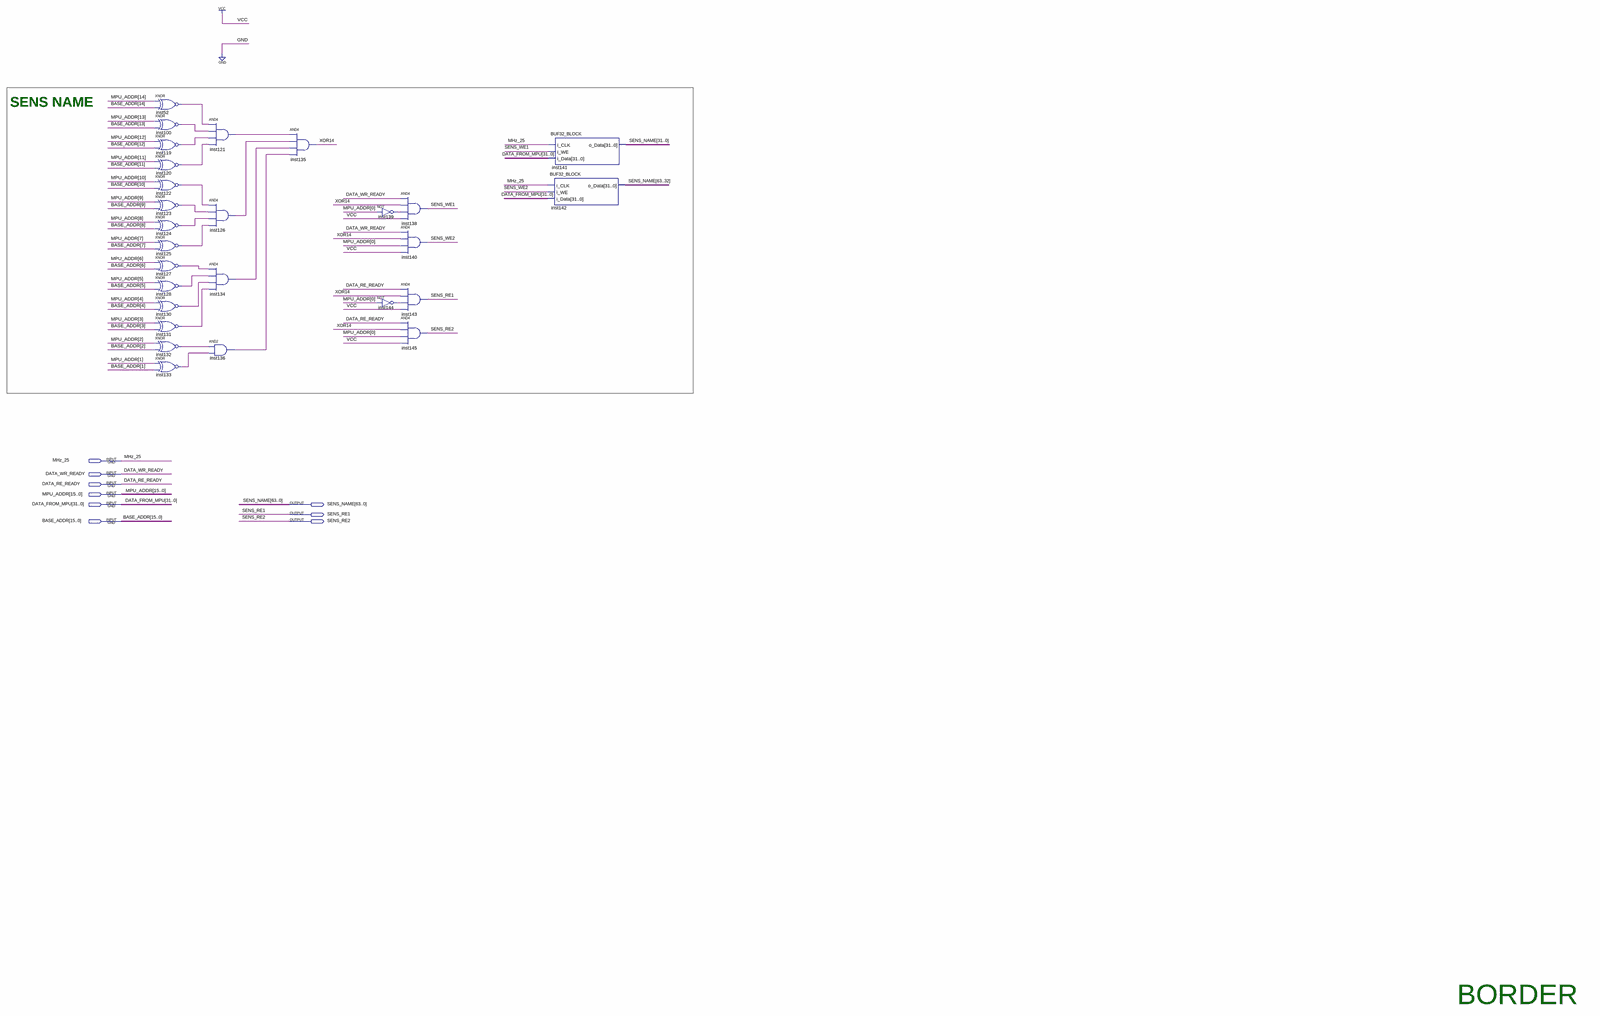
[diagram p0: schematic sheet, whole]
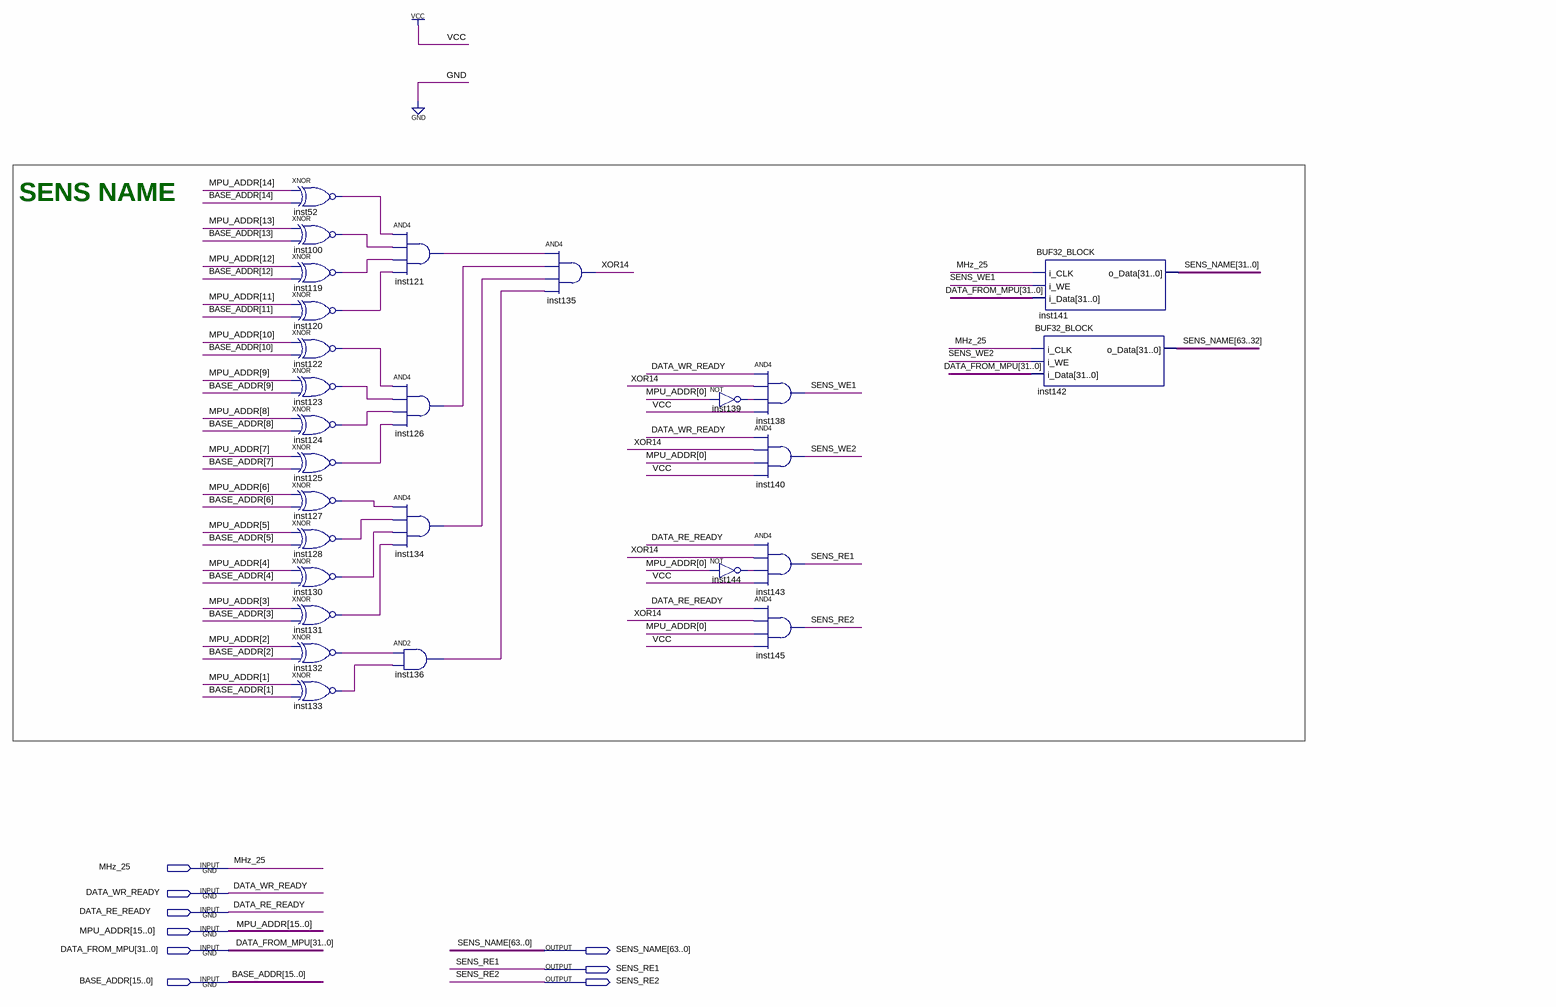
[diagram p1: schematic sheet, upper left part]
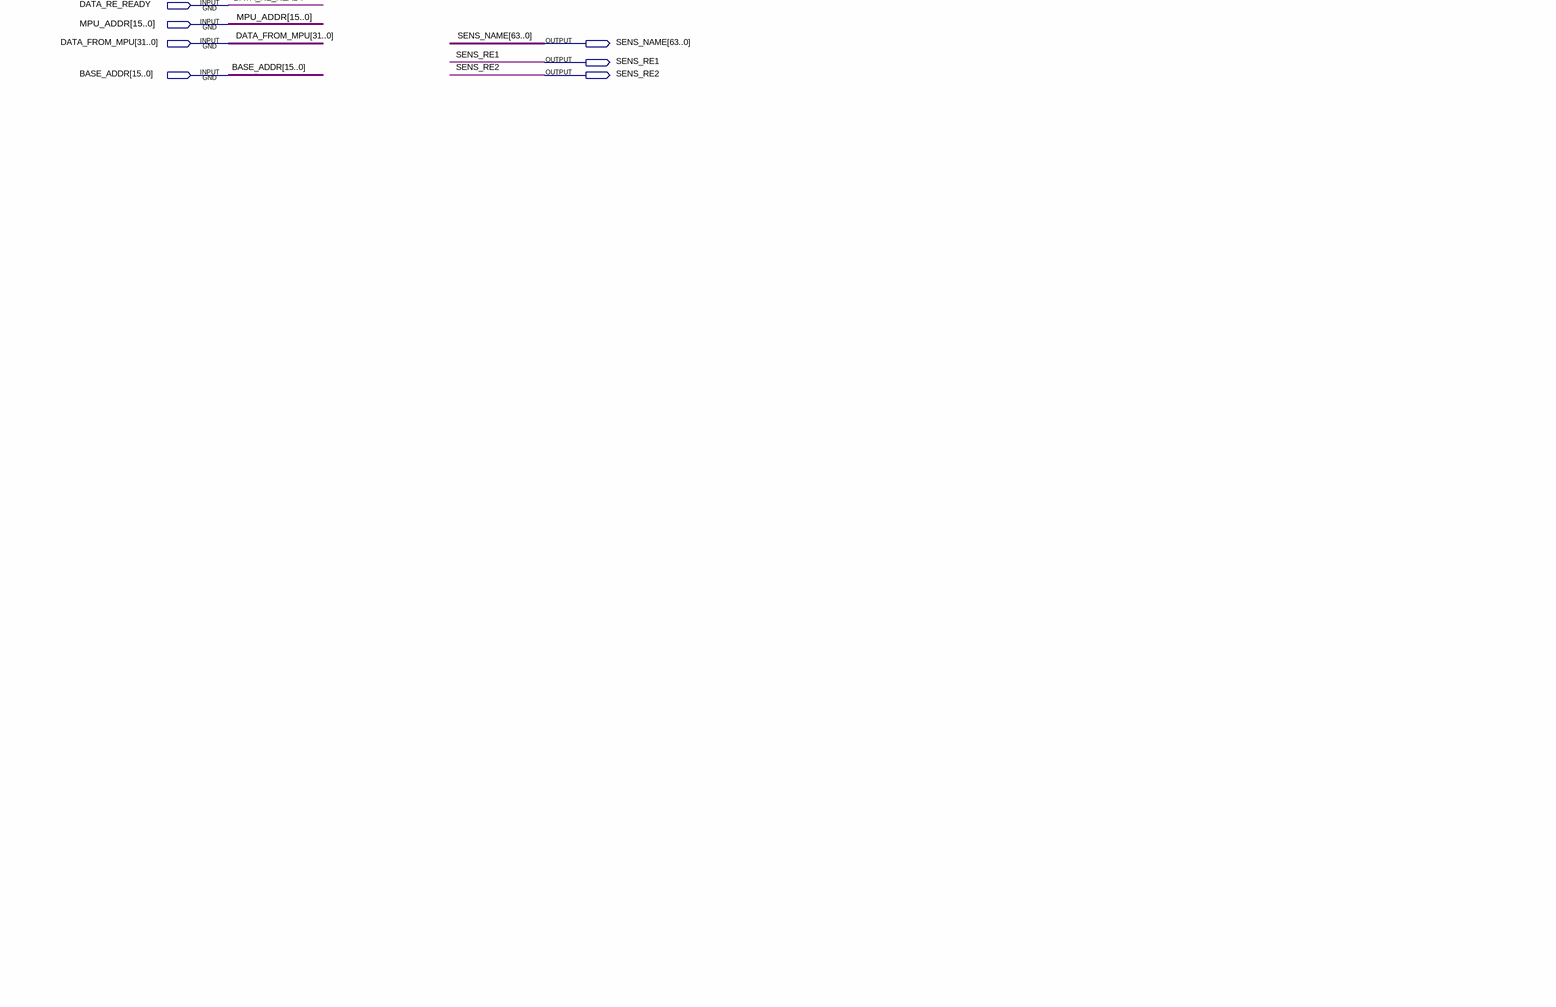
[diagram p2: schematic sheet, lower left part]
// Quartus schematic SENS_NAME.bdf as structural Verilog: 27 symbols, 9 pins
module SENS_NAME (
  input  MHz_25,
  input  DATA_WR_READY,
  input  DATA_RE_READY,
  input  [15:0] MPU_ADDR,
  input  [31:0] DATA_FROM_MPU,
  input  [15:0] BASE_ADDR,
  output [63:0] SENS_NAME,
  output SENS_RE1,
  output SENS_RE2
);

  wire inst52_out, inst100_out, inst119_out, inst120_out, inst121_out, inst122_out, inst123_out, inst124_out,
       inst125_out, inst126_out, inst127_out, inst128_out, inst130_out, inst131_out, inst132_out,
       inst133_out, inst134_out, inst136_out, inst139_out, inst144_out, SENS_WE1, SENS_WE2, XOR14;

  xnor inst52 (inst52_out, MPU_ADDR[14], BASE_ADDR[14]);
  xnor inst100 (inst100_out, MPU_ADDR[13], BASE_ADDR[13]);
  xnor inst119 (inst119_out, MPU_ADDR[12], BASE_ADDR[12]);
  xnor inst120 (inst120_out, MPU_ADDR[11], BASE_ADDR[11]);
  xnor inst122 (inst122_out, MPU_ADDR[10], BASE_ADDR[10]);
  xnor inst123 (inst123_out, MPU_ADDR[9], BASE_ADDR[9]);
  xnor inst124 (inst124_out, MPU_ADDR[8], BASE_ADDR[8]);
  xnor inst125 (inst125_out, MPU_ADDR[7], BASE_ADDR[7]);
  xnor inst127 (inst127_out, MPU_ADDR[6], BASE_ADDR[6]);
  xnor inst128 (inst128_out, MPU_ADDR[5], BASE_ADDR[5]);
  xnor inst130 (inst130_out, MPU_ADDR[4], BASE_ADDR[4]);
  xnor inst131 (inst131_out, MPU_ADDR[3], BASE_ADDR[3]);
  xnor inst132 (inst132_out, MPU_ADDR[2], BASE_ADDR[2]);
  xnor inst133 (inst133_out, MPU_ADDR[1], BASE_ADDR[1]);
  and inst121 (inst121_out, inst52_out, inst100_out, inst119_out, inst120_out);
  and inst126 (inst126_out, inst122_out, inst123_out, inst124_out, inst125_out);
  and inst134 (inst134_out, inst127_out, inst128_out, inst130_out, inst131_out);
  and inst136 (inst136_out, inst132_out, inst133_out);
  and inst135 (XOR14, inst121_out, inst126_out, inst134_out, inst136_out);
  not inst139 (inst139_out, MPU_ADDR[0]);
  not inst144 (inst144_out, MPU_ADDR[0]);
  and inst138 (SENS_WE1, DATA_WR_READY, XOR14, inst139_out, 1'b1);
  and inst140 (SENS_WE2, DATA_WR_READY, XOR14, MPU_ADDR[0], 1'b1);
  and inst143 (SENS_RE1, DATA_RE_READY, XOR14, inst144_out, 1'b1);
  and inst145 (SENS_RE2, DATA_RE_READY, XOR14, MPU_ADDR[0], 1'b1);
  BUF32_BLOCK inst141 (.i_CLK(MHz_25), .i_WE(SENS_WE1), .i_Data(DATA_FROM_MPU), .o_Data(SENS_NAME[31:0]));
  BUF32_BLOCK inst142 (.i_CLK(MHz_25), .i_WE(SENS_WE2), .i_Data(DATA_FROM_MPU), .o_Data(SENS_NAME[63:32]));

  // Notes on the sheet:
  //   SENS NAME
  //   BORDER
endmodule
